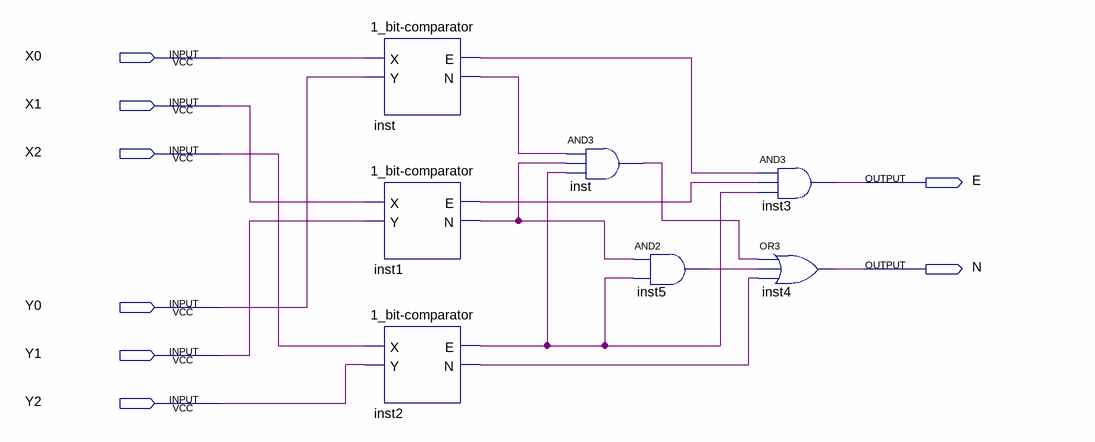
[diagram p0: schematic sheet]
// Quartus schematic problem_1.bdf as structural Verilog: 7 symbols, 8 pins
module problem_1 (
  input  X0,
  input  X1,
  input  X2,
  input  Y0,
  input  Y1,
  input  Y2,
  output E,
  output N
);

  wire inst1_e, inst1_n, inst2_e, inst2_n, inst5_out, inst_e, inst_n, inst_out;

  \1_bit-comparator  inst (.X(X0), .Y(Y0), .E(inst_e), .N(inst_n));
  \1_bit-comparator  inst1 (.X(X1), .Y(Y1), .E(inst1_e), .N(inst1_n));
  \1_bit-comparator  inst2 (.X(X2), .Y(Y2), .E(inst2_e), .N(inst2_n));
  and inst_dup2 (inst_out, inst_n, inst1_n, inst2_e);
  and inst5 (inst5_out, inst1_n, inst2_e);
  and inst3 (E, inst_e, inst1_e, inst2_e);
  or inst4 (N, inst_out, inst5_out, inst2_n);
endmodule
